# Altium schematic sheet ucus_kayit.SchDoc
size A4
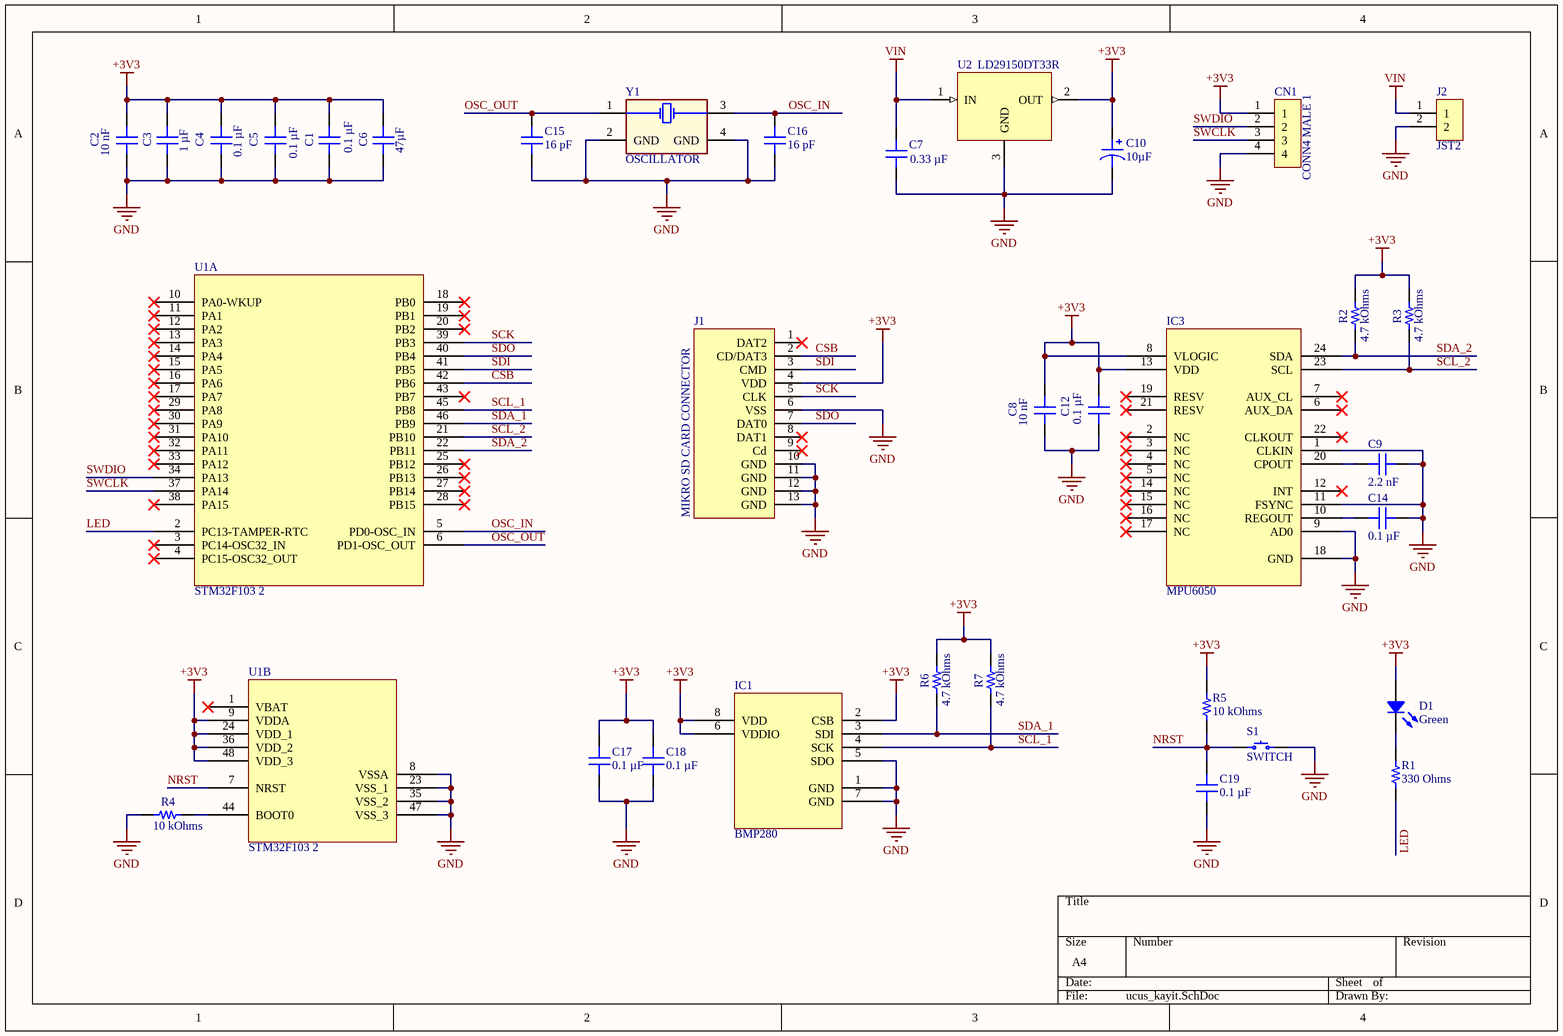
[diagram p0: ucus_kayit.SchDoc]

## Parts
C1  0.1 µF  [CAP 1206_3216 - 0.8MM]
C2  10 nF  [CAP 1206_3216 - 0.8MM]
C3  1 µF  [CAP 1206_3216 - 0.8MM]
C4  0.1 µF  [CAP 1206_3216 - 0.8MM]
C5  0.1 µF  [CAP 1206_3216 - 0.8MM]
C6  47µF  [CAP 1206_3216 - 1.8MM]
C7  0.33 µF  [CAP 1206_3216 - 0.8MM]
C8  10 nF  [CAP 1206_3216 - 0.8MM]
C9  2.2 nF  [CAP 1206_3216 - 0.8MM]
C10  10µF  [CAP POL 1206_3216]
C12  0.1 µF  [CAP 1206_3216 - 0.8MM]
C14  0.1 µF  [CAP 1206_3216 - 0.8MM]
C15  16 pF  [CAP 1206_3216 - 0.8MM]
C16  16 pF  [CAP 1206_3216 - 0.8MM]
C17  0.1 µF  [CAP 1206_3216 - 0.8MM]
C18  0.1 µF  [CAP 1206_3216 - 0.8MM]
C19  0.1 µF  [CAP 1206_3216 - 0.8MM]
CN1  CONN4 MALE 1  [CONN4 MALE 1]
D1  Green  [LED 0805_2012 GREEN]
IC1  BMP280  [BMP280]
IC3  MPU6050  [QFN]
J1  MIKRO SD CARD CONNECTOR  [MICRO SD CARD CONNECTOR]
J2  JST2  [JST2]
R1  330 Ohms  [RES 1206_3216]
R2  4.7 kOhms  [RES 1206_3216]
R3  4.7 kOhms  [RES 1206_3216]
R4  10 kOhms  [RES 1206_3216]
R5  10 kOhms  [RES 1206_3216]
R6  4.7 kOhms  [RES 1206_3216]
R7  4.7 kOhms  [RES 1206_3216]
S1  SWITCH  [TE FSMSMTR]
U1  STM32F103 2  [LQFP48]  (parts A,B of 2)
U2  LD29150DT33R  [TO252-3]
Y1  OSCILLATOR  [OSCILLATOR]

## Nets
+3V3: C1.2 C2.2 C3.2 C4.2 C5.2 C6.2 C8.2 C10.1 C12.1 C17.2 C18.2 CN1.1 D1.1 IC1.2(CSB) IC1.6(VDDIO) IC1.8(VDD) IC3.8(VLOGIC) IC3.13(VDD) J1.4(VDD) R2.2 R3.2 R5.2 R6.2 R7.2 U1.9(VDDA) U1.24(VDD_1) U1.36(VDD_2) U1.48(VDD_3) U2.2(OUT)
GND: C1.1 C2.1 C3.1 C4.1 C5.1 C6.1 C7.1 C8.1 C9.2 C10.2 C12.2 C14.2 C15.2 C16.2 C17.1 C18.1 C19.1 CN1.4 IC1.1(GND) IC1.5(SDO) IC1.7(GND) IC3.1(CLKIN) IC3.9(AD0) IC3.11(FSYNC) IC3.18(GND) J1.6(VSS) J1.10(GND) J1.11(GND) J1.12(GND) J1.13(GND) J2.2 R4.1 S1.2 U1.8(VSSA) U1.23(VSS_1) U1.35(VSS_2) U1.47(VSS_3) U2.3(GND) Y1.2(GND) Y1.4(GND)
VIN: C7.2 J2.1 U2.1(IN)
CSB: J1.2(CD/DAT3) U1.42(PB6)
LED: R1.2 U1.2(PC13-TAMPER-RTC)
NRST: C19.2 R5.1 S1.1 U1.7(NRST)
OSC_IN: C16.1 U1.5(PD0-OSC_IN) Y1.3
OSC_OUT: C15.1 U1.6(PD1-OSC_OUT) Y1.1
SCK: J1.5(CLK) U1.39(PB3)
SCL_1: IC1.4(SCK) R7.1 U1.45(PB8)
SCL_2: IC3.23(SCL) R3.1 U1.21(PB10)
SDA_1: IC1.3(SDI) R6.1 U1.46(PB9)
SDA_2: IC3.24(SDA) R2.1 U1.22(PB11)
SDI: J1.3(CMD) U1.41(PB5)
SDO: J1.7(DAT0) U1.40(PB4)
SWCLK: CN1.3 U1.37(PA14)
SWDIO: CN1.2 U1.34(PA13)
NetC9_1: C9.1 IC3.20(CPOUT)
NetC14_1: C14.1 IC3.10(REGOUT)
NetD1_2: D1.2 R1.1
NetR4_2: R4.2 U1.44(BOOT0)

Not connected (* = marked no-connect by the designer): IC3 2(NC)* 3(NC)* 4(NC)* 5(NC)* 6(AUX_DA)* 7(AUX_CL)* 12(INT)* 14(NC)* 15(NC)* 16(NC)* 17(NC)* 19(RESV)* 21(RESV)* 22(CLKOUT)*; J1 1(DAT2)* 8(DAT1)* 9(Cd)*; U1 1(VBAT)* 3(PC14-OSC32_IN)* 4(PC15-OSC32_OUT)* 10(PA0-WKUP)* 11(PA1)* 12(PA2)* 13(PA3)* 14(PA4)* 15(PA5)* 16(PA6)* 17(PA7)* 18(PB0)* 19(PB1)* 20(PB2)* 25(PB12)* 26(PB13)* 27(PB14)* 28(PB15)* 29(PA8)* 30(PA9)* 31(PA10)* 32(PA11)* 33(PA12)* 38(PA15)* 43(PB7)*

## Library data of the parts
C1 C4 C5 C12 C14 C17-C19 = 1206B104M500CT: CAP CER 0.1UF 50V X7R 1206; manufacturer: Walsin Technology Corporation; Tolerance: ±20%; Part Number: 1206B104M500CT; Value: 0.1 µF; Applications: General Purpose; Capacitance: 0.1 µF; componentlink1description: Datasheet; componentlink1url: http://www.passivecomponent.com/wp-content/uploads/2018/10/MLCC.pdf; componentlink2description: DigiKey Link; componentlink2url: https://www.digikey.com/en/products/detail/walsin-technology-corporation/1206B104M500CT/9355103; Device Package: 1206 (3216 Metric); lastupdated: 2.04.2022 06:00:47; Lifecycle Status: Active; Minimum Order: 1; Mounting Type: Surface Mount, MLCC; Operating Temperature: -55°C ~ 125°C; Package / Case: 1206 (3216 Metric); packaging: TapeAndReel; partid: 41385; Part Status: Active; price: 0.02; series: -; Size / Dimension: 0.126" L x 0.063" W (3.20mm x 1.60mm); Supplier 1: DigiKey; Supplier Part Number 1: 1292-1606-1-ND; Temperature Coefficient: X7R; Thickness (Max): 0.035" (0.90mm); Voltage - Rated: 50V
C2 C8 = C1206C103F3GECAUTO: CAP CER 1206 10NF 25V C0G 1%; manufacturer: KEMET; Capacitance: 10000 pF; Temperature Coefficient: C0G, NP0; Part Number: C1206C103F3GECAUTO; Value: 10 nF; Applications: Automotive, ESD Protection; componentlink1description: Datasheet; componentlink1url: https://api.kemet.com/component-edge/download/datasheet/C1206C103F3GECAUTO.pdf; componentlink2description: DigiKey Link; componentlink2url: https://www.digikey.com/en/products/detail/kemet/C1206C103F3GECAUTO/8647500; Device Package: 1206 (3216 Metric); Features: Low ESL; lastupdated: 3.01.2023 20:12:33; Lifecycle Status: Active; Minimum Order: 1; Mounting Type: Surface Mount, MLCC; Operating Temperature: -55°C ~ 125°C; Package / Case: 1206 (3216 Metric); packaging: TapeAndReel; partid: 30341; Part Status: Active; price: 0.67; Ratings: AEC-Q200; series: ESD SMD Auto C0G; Size / Dimension: 0.126" L x 0.063" W (3.20mm x 1.60mm); Supplier 1: DigiKey; Supplier Part Number 1: 399-C1206C103F3GECAUTOCT-ND; Thickness (Max): 0.039" (1.00mm); Tolerance: ±1%; Voltage - Rated: 25V
C3 = C1206X105K3RAC3316: CAP CER 1206 1UF 25V X7R; manufacturer: KEMET; Tolerance: ±10%; Part Number: C1206X105K3RAC3316; Value: 1 µF; Applications: Automotive, Boardflex Sensitive; Capacitance: 1 µF; componentlink1description: Datasheet; componentlink1url: https://api.kemet.com/component-edge/download/datasheet/C1206X105K3RAC3316.pdf; componentlink2description: DigiKey Link; componentlink2url: https://www.digikey.com/en/products/detail/kemet/C1206X105K3RAC3316/10315781; Device Package: 1206 (3216 Metric); Features: Soft Termination; lastupdated: 2.04.2022 06:00:41; Lifecycle Status: Active; Minimum Order: 1; Mounting Type: Surface Mount, MLCC; Operating Temperature: -55°C ~ 125°C; Package / Case: 1206 (3216 Metric); packaging: TapeAndReel; partid: 19010; Part Status: Active; price: 0.32; Ratings: AEC-Q200; series: SMD Auto X7R VW80808; Size / Dimension: 0.130" L x 0.063" W (3.30mm x 1.60mm); Supplier 1: DigiKey; Supplier Part Number 1: 399-C1206X105K3RAC3316CT-ND; Temperature Coefficient: X7R; Thickness (Max): 0.047" (1.20mm); Voltage - Rated: 25V
C6 = 12066D476MAT2A: CAP CER 47UF 6.3V X5R 1206; manufacturer: AVX Corporation; Tolerance: ±20%; Part Number: 12066D476MAT2A; Value: 47µF; Applications: General Purpose; Capacitance: 47µF; componentlink1description: Datasheet; componentlink1url: http://datasheets.avx.com/cx5r.pdf; componentlink2description: DigiKey Link; componentlink2url: http://digikey.com/product-detail/en/avx-corporation/12066D476MAT2A/478-4532-1-ND/1645883; Device Package: 1206 (3216 Metric); lastupdated: 2.09.2020 01:05:23; Lifecycle Status: Active; Minimum Order: 1; Mounting Type: Surface Mount, MLCC; Operating Temperature: -55°C ~ 85°C; Package / Case: 1206 (3216 Metric); packaging: TapeAndReel; partid: 22636; Part Status: Active; price: 0.23; series: -; Size / Dimension: 0.126" L x 0.063" W (3.20mm x 1.60mm); Supplier 1: DigiKey; Supplier Part Number 1: 478-4532-1-ND; Temperature Coefficient: X5R; Thickness (Max): 0.070" (1.78mm); Voltage - Rated: 6.3V
C7 = C1206X334K3RAC7800: CAP CER 0.33UF 25V X7R 1206; manufacturer: KEMET; Tolerance: ±10%; Part Number: C1206X334K3RAC7800; Value: 0.33 µF; Applications: Boardflex Sensitive; Capacitance: 0.33 µF; componentlink1description: Datasheet; componentlink1url: https://api.kemet.com/component-edge/download/datasheet/C1206X334K3RAC7800.pdf; componentlink2description: DigiKey Link; componentlink2url: https://www.digikey.com/en/products/detail/kemet/C1206X334K3RAC7800/6097286; Device Package: 1206 (3216 Metric); Features: Soft Termination; lastupdated: 3.01.2023 20:13:14; Lifecycle Status: Active; Minimum Order: 1; Mounting Type: Surface Mount, MLCC; Operating Temperature: -55°C ~ 125°C; Package / Case: 1206 (3216 Metric); packaging: TapeAndReel; partid: 18929; Part Status: Active; price: 0.20; series: SMD Comm X7R Flex; Size / Dimension: 0.130" L x 0.063" W (3.30mm x 1.60mm); Supplier 1: DigiKey; Supplier Part Number 1: 399-20222-1-ND; Temperature Coefficient: X7R; Thickness (Max): 0.039" (0.98mm); Voltage - Rated: 25V
C9 = C1206C222K5GEC7210: CAP CER 1206 2.2NF 50V C0G 10%; manufacturer: KEMET; Capacitance: 2200 pF; Temperature Coefficient: C0G, NP0; Part Number: C1206C222K5GEC7210; Value: 2.2 nF; Applications: ESD Protection; componentlink1description: Datasheet; componentlink1url: https://api.kemet.com/component-edge/download/datasheet/C1206C222K5GEC7210.pdf; componentlink2description: DigiKey Link; componentlink2url: https://www.digikey.com/en/products/detail/kemet/C1206C222K5GEC7210/8646303; Device Package: 1206 (3216 Metric); Features: Low ESL; lastupdated: 3.01.2023 20:12:29; Lifecycle Status: Active; Minimum Order: 1; Mounting Type: Surface Mount, MLCC; Operating Temperature: -55°C ~ 125°C; Package / Case: 1206 (3216 Metric); packaging: TapeAndReel; partid: 30052; Part Status: Active; price: 0.04; series: ESD SMD Comm C0G; Size / Dimension: 0.126" L x 0.063" W (3.20mm x 1.60mm); Supplier 1: DigiKey; Supplier Part Number 1: 399-C1206C222K5GEC7210CT-ND; Thickness (Max): 0.047" (1.20mm); Tolerance: ±10%; Voltage - Rated: 50V
C10 = F951E106MAAAQ2: CAP TANT 10UF 20% 25V 1206; manufacturer: AVX Corporation; Manufacturer Size Code: A; ESR (Equivalent Series Resistance): 2Ohm; Type: Conformal Coated; Part Number: F951E106MAAAQ2; Value: 10µF; Capacitance: 10µF; componentlink1description: Datasheet; componentlink1url: http://datasheets.avx.com/F95.pdf; componentlink2description: DigiKey Link; componentlink2url: http://digikey.com/product-detail/en/avx-corporation/F951E106MAAAQ2/478-8496-1-ND/4005728; Device Package: 1206 (3216 Metric); Features: General Purpose; Height - Seated (Max): 0.063" (1.60mm); lastupdated: 2.09.2020 01:15:59; Lifecycle Status: Active; Minimum Order: 1; Mounting Type: Surface Mount; Operating Temperature: -55°C ~ 125°C; Package / Case: 1206 (3216 Metric); packaging: TapeAndReel; partid: 173; Part Status: Active; price: 0.28; series: F95, Frameless™; Size / Dimension: 0.126" L x 0.067" W (3.20mm x 1.70mm); Supplier 1: DigiKey; Supplier Part Number 1: 478-8496-1-ND; Tolerance: ±20%; Voltage - Rated: 25V
C15 C16 = C1206C160J5GAC7800: CAP CER 16PF 50V NP0 1206; manufacturer: KEMET; Temperature Coefficient: C0G, NP0; Tolerance: ±5%; Part Number: C1206C160J5GAC7800; Value: 16 pF; Applications: General Purpose; Capacitance: 16 pF; componentlink1description: Datasheet; componentlink1url: https://api.kemet.com/component-edge/download/datasheet/C1206C160J5GACTU.pdf; componentlink2description: DigiKey Link; componentlink2url: https://www.digikey.com/en/products/detail/kemet/C1206C160J5GAC7800/2215316; Device Package: 1206 (3216 Metric); Features: Low ESL; lastupdated: 2.04.2022 06:00:48; Lifecycle Status: Active; Minimum Order: 1; Mounting Type: Surface Mount, MLCC; Operating Temperature: -55°C ~ 125°C; Package / Case: 1206 (3216 Metric); packaging: TapeAndReel; partid: 40774; Part Status: Active; price: 0.08; series: SMD Comm C0G; Size / Dimension: 0.126" L x 0.063" W (3.20mm x 1.60mm); Supplier 1: DigiKey; Supplier Part Number 1: 399-17465-1-ND; Thickness (Max): 0.035" (0.88mm); Voltage - Rated: 50V
CN1 = CONN4 MALE 1: 4 PIN 2.54MM
D1 = 5975316507F: LED GREEN 0805 SMD; Manufacturer: Dialight; Configuration: Standard; Current - Test: 20mA; Lens Color: 0.93mm; Lens Size: 1.40mm x 1.24mm; Lens Style: Rectangle with Flat Top; Millicandela Rating: 16mcd; Voltage - Forward (Vf) (Typ): 2.2V; Wavelength - Dominant: 560nm; Part Number: 5975316507F; Color: Green; ComponentLink1Description: Datasheet; ComponentLink1URL: http://www.dialightsignalsandcomponents.com/Assets/Drawings/2D_Drawings_DrawingDetailedSpec/NewDrawings/18370A.pdf; ComponentLink2Description: DigiKey Link; ComponentLink2URL: https://www.digikey.com/en/products/detail/dialight/5975316507F/9385444; Device Package: 0805 (2012 Metric); Height (Max): 0.93mm; LastUpdated: 2.04.2022 06:37:24; Lifecycle Status: Active; Minimum Order: 1; Mounting Type: Surface Mount; Package / Case: 0805 (2012 Metric); Packaging: TapeAndReel; PartId: 245; Part Status: Active; Price: 0.13; Series: 597; Size / Dimension: 2.00mm L x 1.25mm W; Supplier 1: DigiKey; Supplier Part Number 1: 350-4389-1-ND; Supplier Device Package: 0805; Value: Green
IC3 = MPU6050: IC-6050 SENSOR MOTION QFN24
J2 = JST2: 2 PIN 2.54MM
R1 = RC1206JR-07330RL: RES 330 OHM 5% 1/4W 1206; Manufacturer: Yageo; Power (Watts): 0.25W, 1/4W; Temperature Coefficient: ±100ppm/°C; Part Number: RC1206JR-07330RL; ComponentLink1Description: Datasheet; ComponentLink1URL: https://www.yageo.com/upload/media/product/productsearch/datasheet/rchip/PYu-RC_Group_51_RoHS_L_10.pdf; ComponentLink2Description: DigiKey Link; ComponentLink2URL: https://www.digikey.com/en/products/detail/yageo/RC1206JR-07330RL/729279; Composition: Thick Film; Device Package: 1206 (3216 Metric); Features: Moisture Resistant; Height - Seated (Max): 0.026" (0.65mm); LastUpdated: 2.01.2023 20:37:30; Lifecycle Status: Active; Minimum Order: 1; Number of Terminations: 2; Operating Temperature: -55°C ~ 155°C; Package / Case: 1206 (3216 Metric); Packaging: TapeAndReel; PartId: 27876; Part Status: Active; Price: 0.01; Resistance: 330 Ohms; Series: RC_L; Size / Dimension: 0.122" L x 0.063" W (3.10mm x 1.60mm); Supplier 1: DigiKey; Supplier Part Number 1: 311-330ERCT-ND; Supplier Device Package: 1206; Tolerance: ±5%; Value: 330 Ohms
R2 R3 R6 R7 = TNPW12064K70BEEA: RES 4.7K OHM 0.1% 2/5W 1206; Manufacturer: Vishay Dale; Power (Watts): 0.4W, 2/5W; Temperature Coefficient: ±25ppm/°C; Part Number: TNPW12064K70BEEA; ComponentLink1Description: Datasheet; ComponentLink1URL: http://www.vishay.com/docs/28758/tnpw_e3.pdf; ComponentLink2Description: DigiKey Link; ComponentLink2URL: https://www.digikey.com/en/products/detail/vishay-dale/TNPW12064K70BEEA/1607929; Composition: Thin Film; Device Package: 1206 (3216 Metric); Features: Anti-Sulfur, Automotive AEC-Q200, Moisture Resistant; Height - Seated (Max): 0.026" (0.65mm); LastUpdated: 2.04.2022 06:19:59; Lifecycle Status: Active; Minimum Order: 1; Number of Terminations: 2; Operating Temperature: -55°C ~ 155°C; Package / Case: 1206 (3216 Metric); Packaging: TapeAndReel; PartId: 35087; Part Status: Active; Price: 0.20; Ratings: AEC-Q200; Resistance: 4.7 kOhms; Series: TNPW e3; Size / Dimension: 0.126" L x 0.063" W (3.20mm x 1.60mm); Supplier 1: DigiKey; Supplier Part Number 1: 541-3881-1-ND; Supplier Device Package: 1206; Tolerance: ±0.1%; Value: 4.7 kOhms
R4 R5 = CRCW120610K0FKTA: RES SMD 10K OHM 1% 1/4W 1206; Manufacturer: Vishay Dale; Power (Watts): 0.25W, 1/4W; Temperature Coefficient: ±100ppm/°C; Part Number: CRCW120610K0FKTA; ComponentLink1Description: Datasheet; ComponentLink1URL: http://www.vishay.com/docs/20008/dcrcw.pdf; ComponentLink2Description: DigiKey Link; ComponentLink2URL: http://digikey.com/product-detail/en/vishay-dale/CRCW120610K0FKTA/541-CRCW120610K0FKTACT-ND/11500860; Composition: Thick Film; Device Package: 1206 (3216 Metric); Features: Automotive AEC-Q200; LastUpdated: 2.04.2022 06:19:13; Lifecycle Status: Active; Minimum Order: 1; Number of Terminations: 2; Operating Temperature: -55°C ~ 155°C; Package / Case: 1206 (3216 Metric); Packaging: TapeAndReel; PartId: 57020; Price: 0.02; Ratings: AEC-Q200; Resistance: 10 kOhms; Series: CRCW; Supplier 1: DigiKey; Supplier Part Number 1: 541-CRCW120610K0FKTACT-ND; Supplier Device Package: 1206; Tolerance: ±1%; Value: 10 kOhms
S1 = TACT SWITCH: SMD 2 Pin Switch; ComponentLink1Description: Datasheet; ComponentLink1URL: https://www.te.com/commerce/DocumentDelivery/DDEController?Action=srchrtrv&DocNm=1437566-3&DocType=Customer+Drawing&DocLang=English
U2 = LD29150DT33R: 3V3
Y1 = OSCILLATOR: 8MHZ 12.5pF